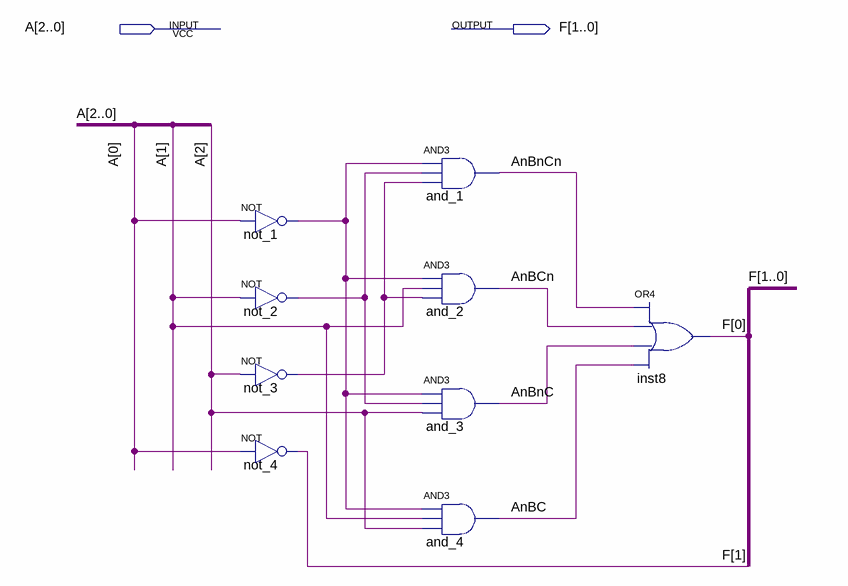
[diagram p0: schematic sheet]
// Quartus schematic And_Or_1.bdf as structural Verilog: 9 symbols, 2 pins
module And_Or_1 (
  input  [2:0] A,
  output [1:0] F
);

  wire AnBC, AnBCn, AnBnC, AnBnCn, not_1_out, not_2_out, not_3_out;

  not not_1 (not_1_out, A[0]);
  not not_2 (not_2_out, A[1]);
  not not_3 (not_3_out, A[2]);
  not not_4 (F[1], A[0]);
  and and_1 (AnBnCn, not_1_out, not_2_out, not_3_out);
  and and_2 (AnBCn, not_1_out, A[1], not_3_out);
  and and_3 (AnBnC, not_1_out, not_2_out, A[2]);
  and and_4 (AnBC, not_1_out, A[1], A[2]);
  or inst8 (F[0], AnBnCn, AnBCn, AnBnC, AnBC);
endmodule
